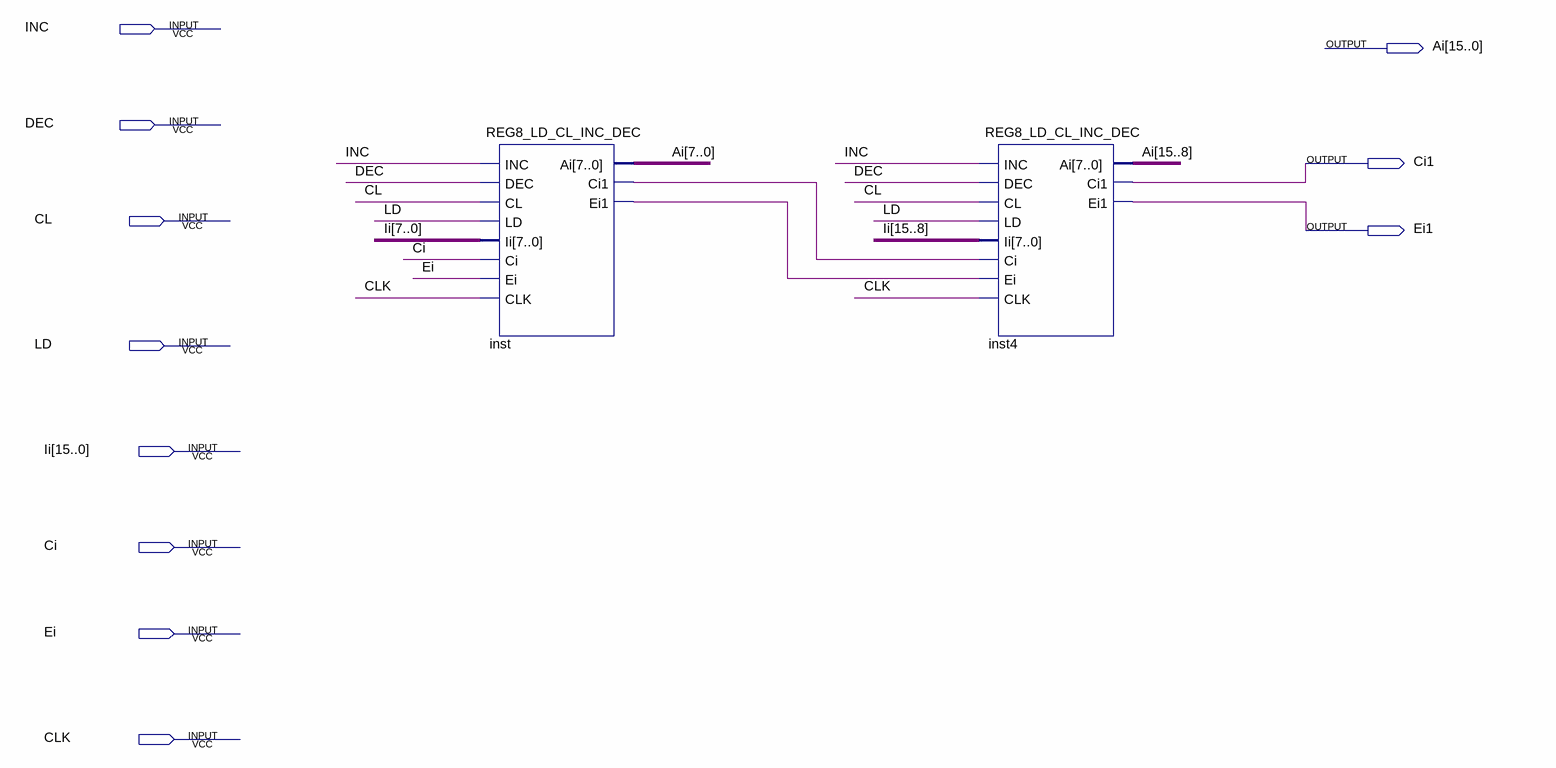
[diagram p0: schematic sheet]
// Quartus schematic REG16_LD_CL_INC_DEC.bdf as structural Verilog: 2 symbols, 11 pins
module REG16_LD_CL_INC_DEC (
  input  INC,
  input  DEC,
  input  CL,
  input  LD,
  input  [15:0] Ii,
  input  Ci,
  input  Ei,
  input  CLK,
  output [15:0] Ai,
  output Ci1,
  output Ei1
);

  wire inst_ci1, inst_ei1;

  REG8_LD_CL_INC_DEC inst (
    .INC(INC), .DEC(DEC), .CL(CL), .LD(LD), .Ii(Ii[7:0]), .Ci(Ci), .Ei(Ei), .CLK(CLK), .Ai(Ai[7:0]),
    .Ci1(inst_ci1), .Ei1(inst_ei1));
  REG8_LD_CL_INC_DEC inst4 (
    .INC(INC), .DEC(DEC), .CL(CL), .LD(LD), .Ii(Ii[15:8]), .Ci(inst_ci1), .Ei(inst_ei1), .CLK(CLK),
    .Ai(Ai[15:8]), .Ci1(Ci1), .Ei1(Ei1));
endmodule
